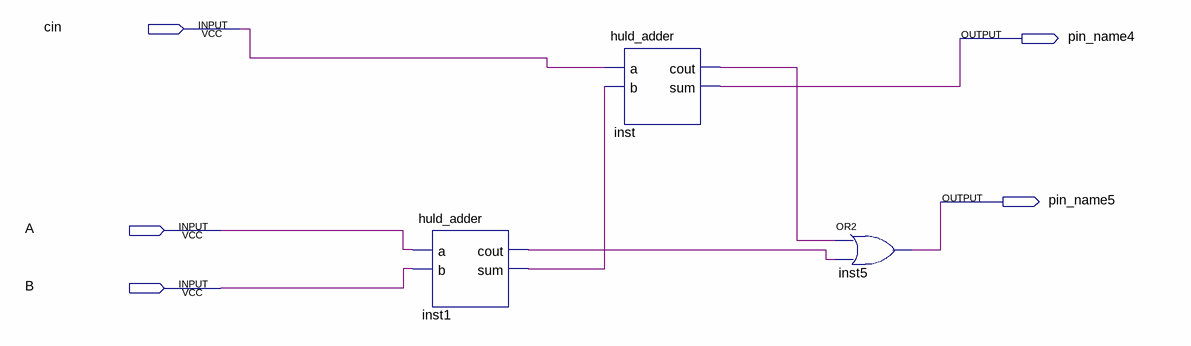
[diagram p0: schematic sheet]
// Quartus schematic hulf_adder.bdf as structural Verilog: 3 symbols, 5 pins
module hulf_adder (
  input  cin,
  input  A,
  input  B,
  output pin_name4,
  output pin_name5
);

  wire inst1_cout, inst1_sum, inst_cout;

  huld_adder inst1 (.a(A), .b(B), .cout(inst1_cout), .sum(inst1_sum));
  huld_adder inst (.a(cin), .b(inst1_sum), .cout(inst_cout), .sum(pin_name4));
  or inst5 (pin_name5, inst_cout, inst1_cout);
endmodule
